# Altium schematic sheet Audio.SchDoc
size A4; SheetNumber: 5; SheetTotal: 7
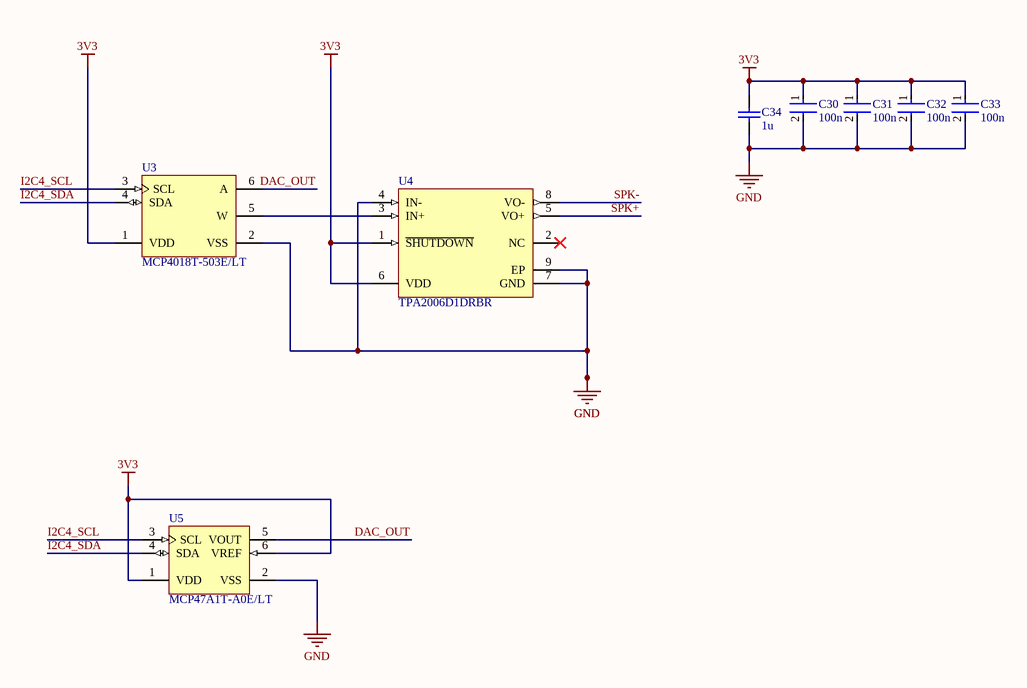
[diagram p0: Audio.SchDoc]

## Parts
C30  100n  [FP-GRM188-0_1-e0_2_0_55-IPC_A]
C31  100n  [FP-GRM188-0_1-e0_2_0_55-IPC_A]
C32  100n  [FP-GRM188-0_1-e0_2_0_55-IPC_A]
C33  100n  [FP-GRM188-0_1-e0_2_0_55-IPC_A]
C34  1u  [CAPC2013X135X45LL10T25]
U3  MCP4018T-503E/LT  [SC70-LT6_N]
U4  TPA2006D1DRBR  [DRB0008A_V]
U5  MCP47A1T-A0E/LT  [MCHP-SC70-LT6_N]

## Nets
3V3: C30.1 C31.1 C32.1 C33.1 C34.2 U3.1(VDD) U4.1(~{SHUTDOWN}) U4.6(VDD) U5.1(VDD) U5.6(VREF)
GND: C30.2 C31.2 C32.2 C33.2 C34.1 U3.2(VSS) U4.4(IN-) U4.7(GND) U4.9(EP) U5.2(VSS)
DAC_OUT: U3.6(A) U5.5(VOUT)
I2C4_SCL: U3.3(SCL) U5.3(SCL)
I2C4_SDA: U3.4(SDA) U5.4(SDA)
SPK+: U4.5(VO+)
SPK-: U4.8(VO-)
NetU3_5: U3.5(W) U4.3(IN+)

Not connected (* = marked no-connect by the designer): U4 2(NC)*

## Library data of the parts
C30-C33 = CMP-2006-02792-2: Chip Multilayer Ceramic Capacitors for General Purpose, 0603, 10uF, X5R, 15%, 20%, 6.3V; Packaging: Tape and Reel; Voltage Rating (DC): 6.3V; Width: 0.031inch; Termination: SMD/SMT; Dielectric: X5R; Package Quantity: 4000; Voltage Rating: 6.3V; Capacitance: 10uF; Case/Package: 0603; Min Operating Temperature: -55°C; Voltage: 6.3V; Length: 1.6mm; Thickness: 0.035inch; Lead Free: Lead Free; Depth: 0.8mm; Case Code (Imperial): 0603; Max Operating Temperature: 85°C; Material: Ceramic; Height: 0.8mm; Tolerance: 20%; Mount: Surface Mount; REACH SVHC: No SVHC; Radiation Hardening: No; Case Code (Metric): 1608
C34 = CMP-1662-00015-2: Chip Capacitor, 4.7 uF, +/- 10%, 16 V, -55 to 85 degC, 0805 (2012 Metric), RoHS, Tape and Reel; PartNumber: GRM21BR61C475KA88L; Voltage Rating (DC): 16 V; Capacitance: 4.7 uF; Type (Capacitors): X5R; Case\/Package: 0805; Pins: 2; DatasheetVersion: 03/2016; REACH SVHC: No SVHC; Tolerance: 10%; Width: 1.25 mm; Mount: Surface Mount; ComponentLink1Description: Manufacturer URL; Case Code (Metric): 2012; PackageDescription: 2-Pin Surface Mount Device, Body 2 x 1.25 mm; Height: 1.25 mm; Voltage Rating: 16 V; Max Operating Temperature: 85 degC; RoHSCompliant: true; Length: 2 mm; ComponentLink1URL: http://www.murata.com/; Mounting Technology: Surface Mount; Packaging: Tape and Reel; Min Operating Temperature: -55 degC; ComponentLink2Description: Datasheet; Case Code (Imperial): 0805; Radiation Hardening: No; Package Quantity: 3000; PackageReference: 0805; ComponentLink2URL: http://search.murata.co.jp/Ceramy/image/img/A01X/G101/ENG/GRM21BR61C475KA88-01.pdf
U3 = CMP-0188-00772-2: 7-Bit Single I2C Digital POT with Volatile Memory, 6-pin SC70, Extended Temperature, Tape and Reel; PackageReference: SC70-LT6; PackageVersion: revBB, Aug-2009; PackageDescription: 6-Lead Plastic Small Outline Transistor (LT) [SC70]; RevisionNote: URLs added.; DatasheetVersion: revA, Mar-2009; ComponentLink3Description: Package Specification; ComponentLink1Description: Manufacturer URL; ComponentLink2URL: http://ww1.microchip.com/downloads/en/DeviceDoc/22147a.pdf; ComponentLink1URL: http://www.microchip.com/; ComponentLink3URL: http://www.microchip.com/stellent/groups/techpub_sg/documents/packagingspec/en012702.pdf; ComponentLink2Description: Datasheet
U4 = CMP-0991-00129-2: 1.45-W Mono Class-D Audio Amplifier with 1.8 V Compatible Shutdown Voltage, -40 to 85 degC, 8-pin SON (DRB8), Green (RoHS & no Sb/Br); Manufacturer: Texas Instruments; Supply Min(Min)(Volt): 2.5; Supply Max(Max)(Volt): 5.5; PSRR(dB): -75; SubFamily: Dynamic Speaker; Output Power(W): 1.45; ComponentLink1Description: Manufacturer URL; ComponentLink3Description: Package Specification; Speaker Amp Type: Class-D; ComponentLink2Description: Datasheet; PartNumber: TPA2006D1DRBR; ComponentLink3URL: http://www.ti.com/litv/pdf/mpds118h; Mounting Technology: Surface Mount; PackageVersion: 4203482-2/K, 06/2012; PackageDescription: 8-Pin Plastic Small Outline, Body 3 x 3 mm, Pitch 0.65 mm; Eco-Plan: Green (RoHS & no Sb/Br); DatasheetVersion: SLOS498A; ComponentLink1URL: http://www.ti.com/; ComponentLink2URL: http://www.ti.com/general/docs/lit/getliterature.tsp?genericPartNumber=TPA2006D1&fileType=pdf; Speaker Channels: Mono; PackageReference: DRB0008A
U5 = CMP-0188-01388-1: 6-Bit Volatile DAC with Command Code, 130 µA Typical Operating Current, -40 to 125 degC, 6-pin SC70 (LT6), Tape and Reel; Manufacturer: Microchip; ComponentLink1URL: http://www.microchip.com; ComponentLink3Description: Package Specification; ComponentLink2URL: http://ww1.microchip.com/downloads/en/DeviceDoc/25154A.pdf; ComponentLink2Description: Datasheet; ComponentLink4URL: http://www.microchip.com/MCP47A1; ComponentLink1Description: Manufacturer URL; ComponentLink3URL: http://www.microchip.com/stellent/groups/techpub_sg/documents/packagingspec/en012702.pdf; PackageDescription: 6-Lead Plastic Small Outline Transistor, 2 x 1.25 mm Body, 0.65 mm Pitch; Mounting Technology: Surface Mount; PackageReference: SC70-LT6; DatasheetVersion: Rev. A; PartNumber: MCP47A1T-A0E/LT; PackageVersion: C04-151A; ComponentLink4Description: Product URL